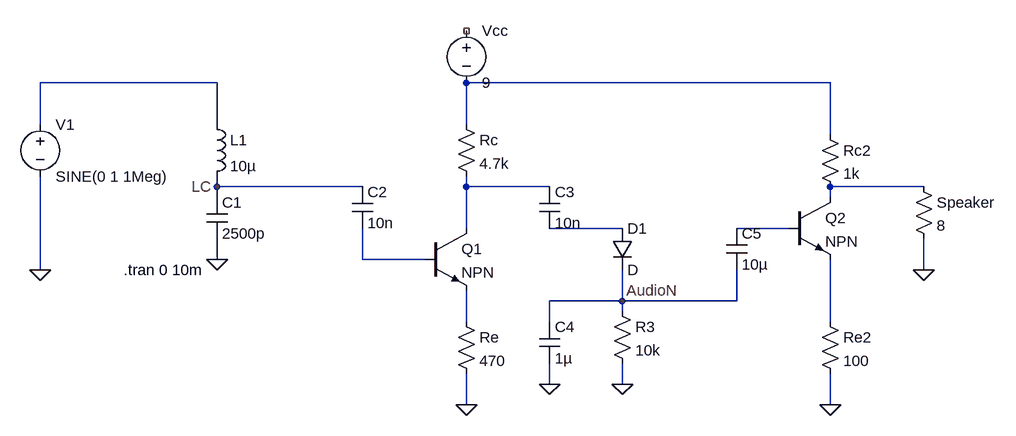
[diagram p0: schematic Draft1AM.asc]
Draft1AM.asc, the LTspice schematic file:
Version 4.1
SHEET 1 1492 680
WIRE 288 -80 16 -80
WIRE 1232 -80 672 -80
WIRE 16 -16 16 -80
WIRE 288 -16 288 -80
WIRE 672 -16 672 -80
WIRE 1232 0 1232 -80
WIRE 288 80 288 64
WIRE 512 80 288 80
WIRE 672 80 672 64
WIRE 800 80 672 80
WIRE 1376 80 1232 80
WIRE 288 96 288 80
WIRE 1232 96 1232 80
WIRE 672 144 672 80
WIRE 912 144 800 144
WIRE 1168 144 1088 144
WIRE 288 192 288 160
WIRE 512 192 512 144
WIRE 608 192 512 192
WIRE 16 208 16 64
WIRE 1376 208 1376 160
WIRE 912 256 912 208
WIRE 912 256 800 256
WIRE 1088 256 1088 208
WIRE 1088 256 912 256
WIRE 912 272 912 256
WIRE 672 288 672 240
WIRE 800 288 800 256
WIRE 1232 288 1232 192
WIRE 800 384 800 352
WIRE 912 384 912 352
WIRE 672 416 672 368
WIRE 1232 416 1232 368
FLAG 16 208 0
FLAG 288 192 0
FLAG 672 416 0
FLAG 912 256 AudioN
FLAG 800 384 0
FLAG 912 384 0
FLAG 1232 416 0
FLAG 1376 208 0
FLAG 288 80 LC
SYMBOL voltage 16 -32 R0
WINDOW 123 0 0 Left 0
WINDOW 39 0 0 Left 0
SYMATTR InstName V1
SYMATTR Value SINE(0 1 1Meg)
SYMBOL ind 272 -32 R0
SYMATTR InstName L1
SYMATTR Value 10µ
SYMBOL cap 272 96 R0
SYMATTR InstName C1
SYMATTR Value 2500p
SYMBOL cap 496 80 R0
SYMATTR InstName C2
SYMATTR Value 10n
SYMBOL npn 608 144 R0
SYMATTR InstName Q1
SYMBOL res 656 -32 R0
SYMATTR InstName Rc
SYMATTR Value 4.7k
SYMBOL res 656 272 R0
SYMATTR InstName Re
SYMATTR Value 470
SYMBOL voltage 672 -176 R0
WINDOW 123 0 0 Left 0
WINDOW 39 0 0 Left 0
SYMATTR InstName Vcc
SYMATTR Value 9
SYMBOL cap 784 80 R0
SYMATTR InstName C3
SYMATTR Value 10n
SYMBOL diode 896 144 R0
SYMATTR InstName D1
SYMBOL res 896 256 R0
SYMATTR InstName R3
SYMATTR Value 10k
SYMBOL cap 784 288 R0
SYMATTR InstName C4
SYMATTR Value 1µ
SYMBOL cap 1072 144 R0
SYMATTR InstName C5
SYMATTR Value 10µ
SYMBOL npn 1168 96 R0
SYMATTR InstName Q2
SYMBOL res 1216 -16 R0
SYMATTR InstName Rc2
SYMATTR Value 1k
SYMBOL res 1216 272 R0
SYMATTR InstName Re2
SYMATTR Value 100
SYMBOL res 1360 64 R0
SYMATTR InstName Speaker
SYMATTR Value 8
TEXT 144 208 Left 2 !.tran 0 10m

The netlist it stands for:
* Draft1AM.asc
V1 N001 0 SINE(0 1 1Meg)
L1 N001 LC 10µ
C1 LC 0 2500p
C2 LC N007 10n
Q1 N003 N007 N008 0 NPN
Rc N002 N003 4.7k
Re N008 0 470
Vcc NC_01 N002 9
C3 N003 N005 10n
D1 N005 AudioN D
R3 AudioN 0 10k
C4 AudioN 0 1µ
C5 N006 AudioN 10µ
Q2 N004 N006 N009 0 NPN
Rc2 N002 N004 1k
Re2 N009 0 100
R§Speaker N004 0 8
.model D D
.lib standard.dio
.model NPN NPN
.model PNP PNP
.lib standard.bjt
.tran 0 10m
.backanno
.end